# Altium schematic sheet Microcontroller.SchDoc
size 420 x 297 mm; Tanım / Description: Wireless Security Detector; Hazırlayan / Prepared By: MFY; Kontrol eden / Checked by: MFY; Onaylayan  /Approved by: MFY; Bölüm / Department: R&D - ARGE; Yayın Tarihi / Rel.date: 11.08.2025; Değ. tarihi / change date: 11.08.2025; Revizyon / Revision: AA; Size: A3
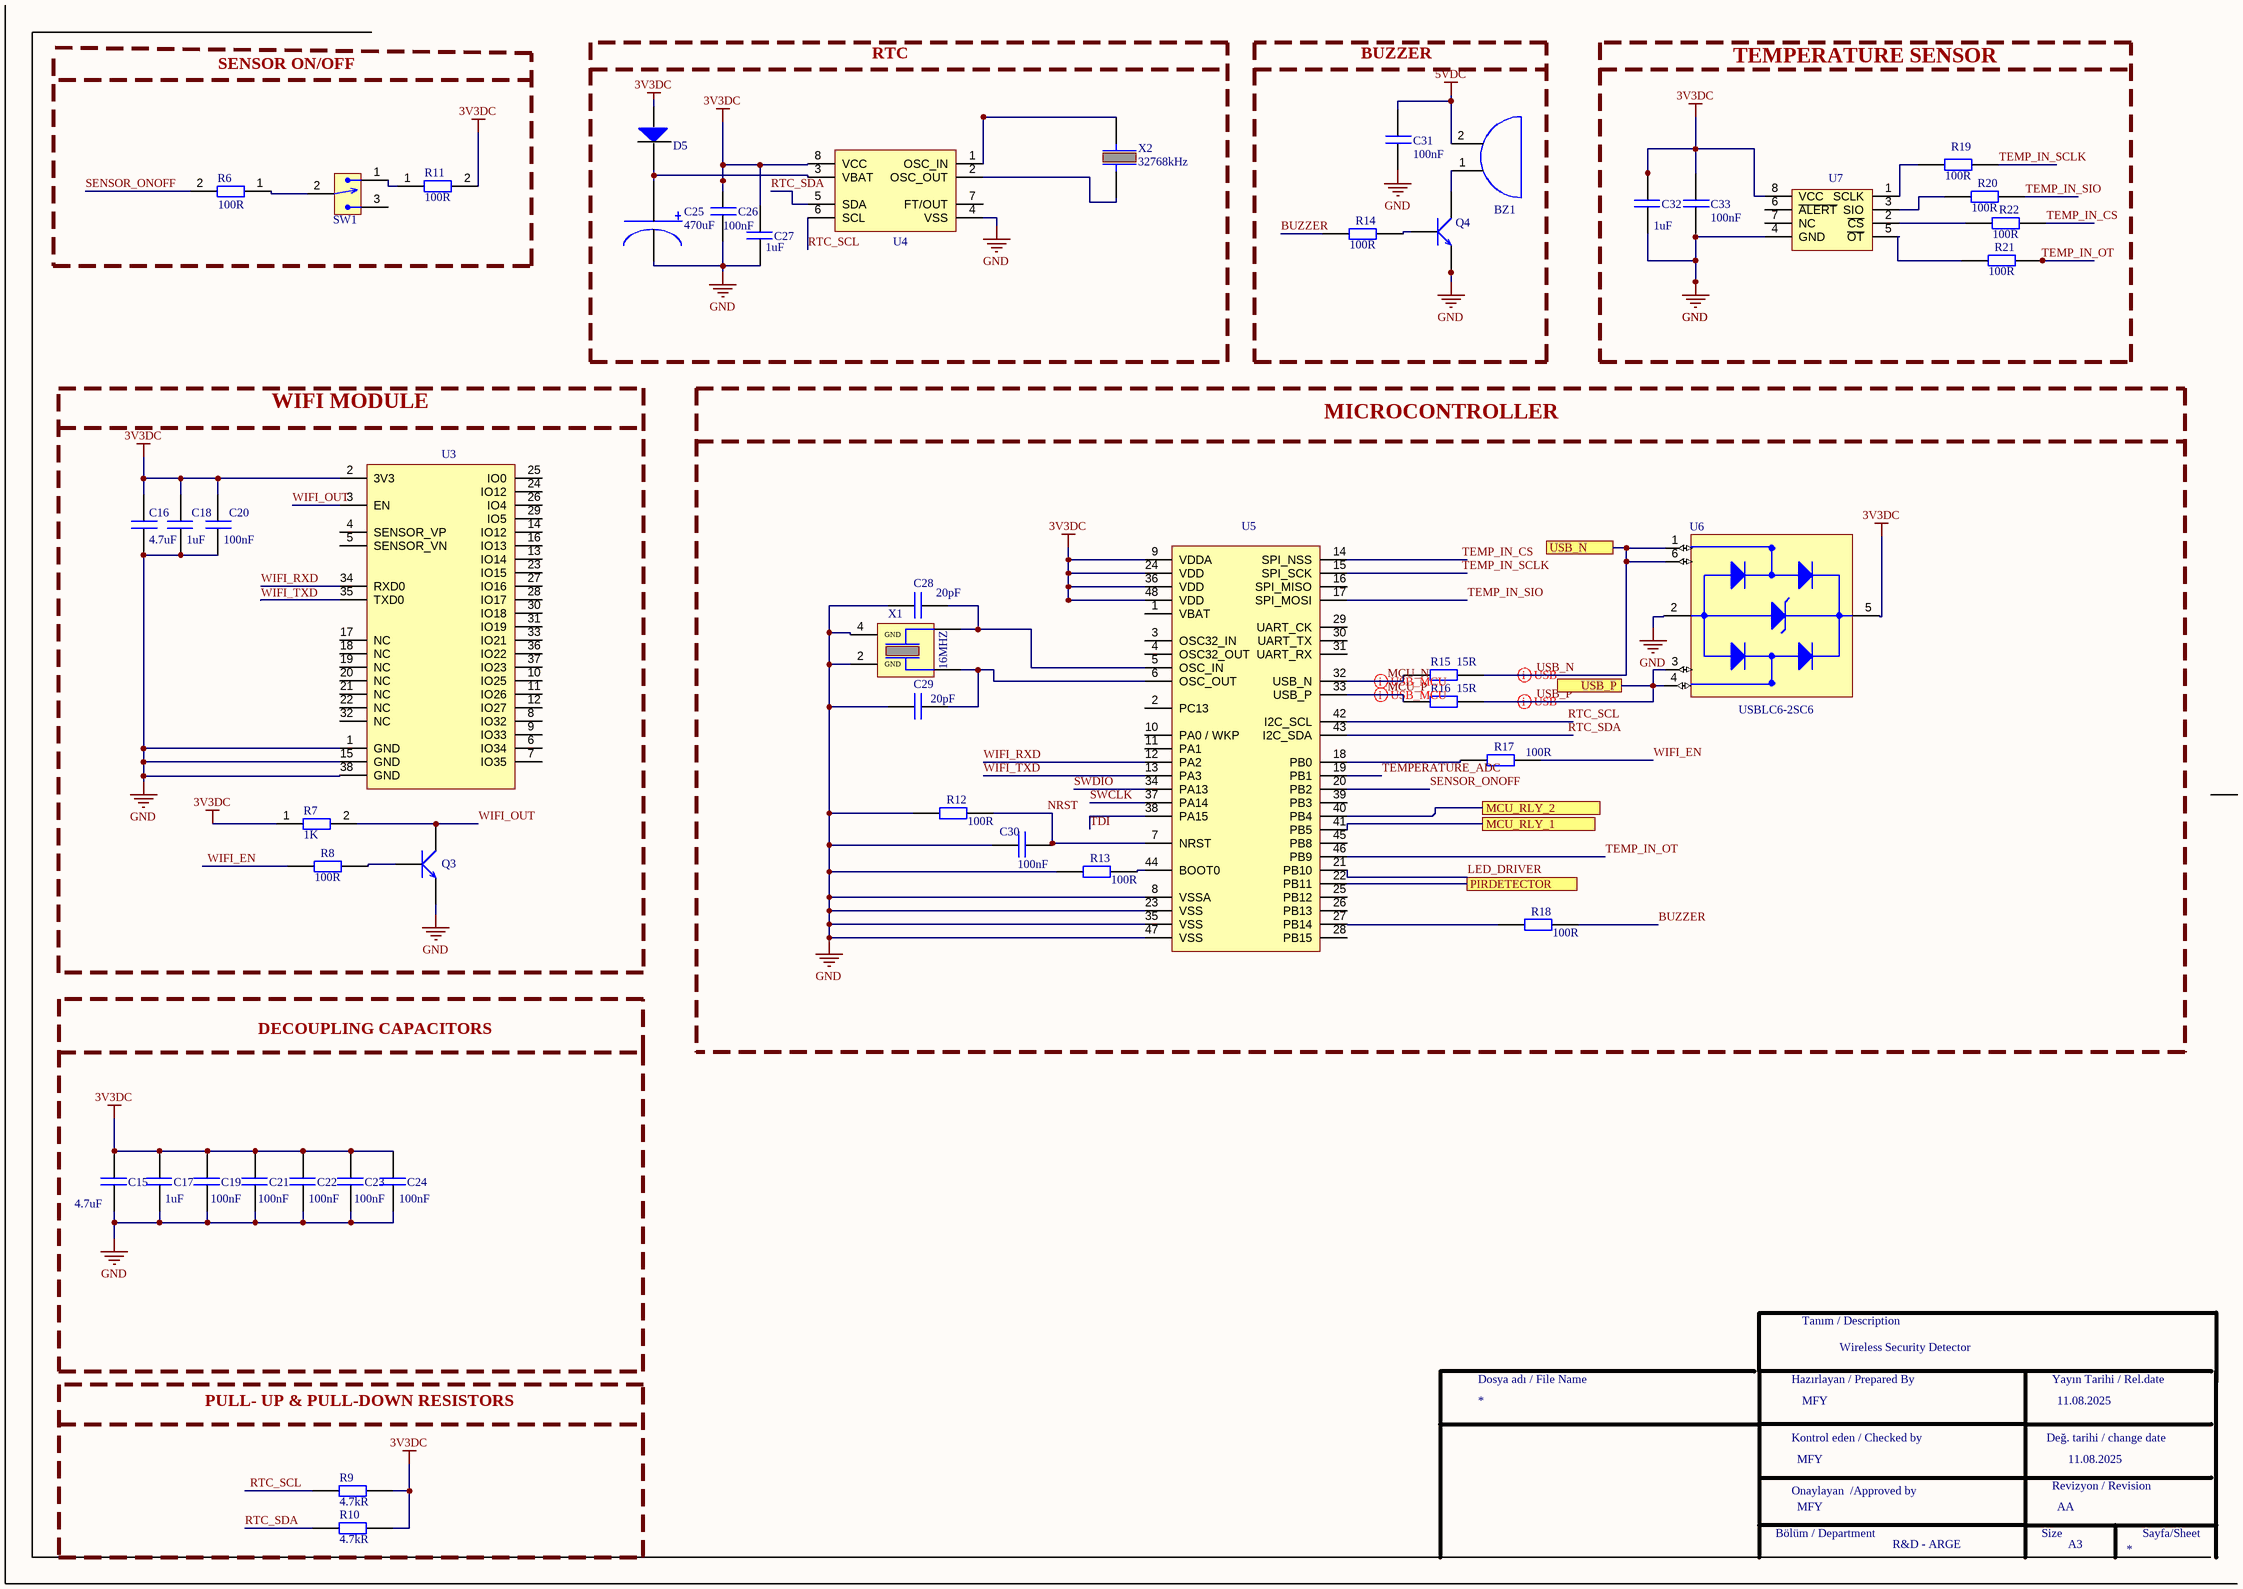
[diagram p0: Microcontroller.SchDoc]

## Parts
BZ1  CMI-9605IC-0580T  [CMI-9605IC-0580T]  (value not drawn)
C15  value 4.7uF  [CAP_0805]  (hidden comment: CL21A475KAQNNNE)
C16  value 4.7uF  [CAP_0805]  (hidden comment: CL21A475KAQNNNE)
C17  value 1uF  [CAP_0805]  (hidden comment: CL21B105KBFNNNE)
C18  value 1uF  [CAP_0805]  (hidden comment: CL21B105KBFNNNE)
C19  value 100nF  [CAP_0603]  (hidden comment: CAP CER 100nF 0603)
C20  value 100nF  [CAP_0805]  (hidden comment: CL21B104KBCNNNC)
C21  value 100nF  [CAP_0603]  (hidden comment: CAP CER 100nF 0603)
C22  value 100nF  [CAP_0603]  (hidden comment: CAP CER 100nF 0603)
C23  value 100nF  [CAP_0603]  (hidden comment: CAP CER 100nF 0603)
C24  value 100nF  [CAP_0603]  (hidden comment: CAP CER 100nF 0603)
C25  value 470uF  [CAP_RADIAL_D10_P5]  (hidden comment: ESH477M050AH4AA)
C26  value 100nF  [CAP_0805]  (hidden comment: CL21B104KBCNNNC)
C27  value 1uF  [CAP_0805]  (hidden comment: CL21B105KBFNNNE)
C28  value 20pF  [CAP_0603]  (hidden comment: CL10C200JB8NNNC)
C29  value 20pF  [CAP_0603]  (hidden comment: CL10C200JB8NNNC)
C30  value 100nF  [CAP_0603]  (hidden comment: CAP CER 100nF 0603)
C31  value 100nF  [CAP_0805]  (hidden comment: CL21B104KBCNNNC)
C32  value 1uF  [CAP_0805]  (hidden comment: CL21B105KBFNNNE)
C33  value 100nF  [CAP_0805]  (hidden comment: CL21B104KBCNNNC)
D5  1N4148WS  [SOD323F]  (value not drawn)
Q3  MMBT3904-7-F  [SOT23-F]  (value not drawn)
Q4  MMBT3904-7-F  [SOT23-F]  (value not drawn)
R6  value 100R  [RES_0603]  (hidden comment: RES 100 OHM 0603)
R7  value 1K  [RES_0603]  (hidden comment: RES 1K OHM 0603)
R8  value 100R  [RES_0603]  (hidden comment: RES 100 OHM 0603)
R9  value 4.7kR  [RES_0603]  (hidden comment: RC0603JR-074K7L)
R10  value 4.7kR  [RES_0603]  (hidden comment: RC0603JR-074K7L)
R11  value 100R  [RES_0603]  (hidden comment: RES 100 OHM 0603)
R12  value 100R  [RES_0603]  (hidden comment: RES 100 OHM 0603)
R13  value 100R  [RES_0603]  (hidden comment: RES 100 OHM 0603)
R14  value 100R  [RES_0603]  (hidden comment: RES 100 OHM 0603)
R15  value 15R  [RES_0603]  (hidden comment: RC0603JR-0715RL)
R16  value 15R  [RES_0603]  (hidden comment: RC0603JR-0715RL)
R17  value 100R  [RES_0603]  (hidden comment: RES 100 OHM 0603)
R18  value 100R  [RES_0603]  (hidden comment: RES 100 OHM 0603)
R19  value 100R  [RES_0603]  (hidden comment: RES 100 OHM 0603)
R20  value 100R  [RES_0603]  (hidden comment: RES 100 OHM 0603)
R21  value 100R  [RES_0603]  (hidden comment: RES 100 OHM 0603)
R22  value 100R  [RES_0603]  (hidden comment: RES 100 OHM 0603)
SW1  EG1215AA  [EG1215AA]  (value not drawn)
U3  ESP32-WROOM-32E(4MB)  [ESP32-32E]  (value not drawn)
U4  M41T00SM6F  [SOIC8]  (value not drawn)
U5  STM32F103C6T6A  [LQFP-48]  (value not drawn)
U6  USBLC6-2SC6  [SOT-23-6L]
U7  MAX6662MSA+  [SOIC8]  (value not drawn)
X1  Operating Frequency-Nom: 16MHZ  [ECS]  (hidden comment: ECS-160-20-30B-TR)
X2  Operating Frequency-Nom: 32768kHz  [ABS-05]  (hidden comment: ABS05-32768KHZ-T)

## Blocks framed on the sheet
RTC: C25-C27 D5 U4 X2
BUZZER: BZ1 C31 Q4 R14
TEMPERATURE SENSOR: C32 C33 R19-R22 U7
WIFI MODULE: C16 C18 C20 Q3 R7 R8 U3
MICROCONTROLLER: C28-C30 R12 R13 R15-R18 U5 U6 X1
PULL- UP & PULL-DOWN RESISTORS: R9 R10

## Ports
MCU_RLY_1 (see PowerManagement[1D]), MCU_RLY_2 (see PowerManagement[2D]), PIRDETECTOR (see PowerManagement[4B]), USB_N (see PowerManagement[3B]), USB_P (see PowerManagement[3B])

## Nets
3V3DC: C15.2 C16.1 C17.2 C18.2 C19.2 C20.1 C21.2 C22.2 C23.2 C24.2 C26.1 C27.2 C32.2 C33.1 D5.2 R7.1 R9.2 R10.2 R11.2 U3.2(3V3) U4.8(VCC) U5.9(VDDA) U5.24(VDD) U5.36(VDD) U5.48(VDD) U6.5(VBUS) U7.8(VCC)
5VDC: BZ1.2 C31.1
GND: C15.1 C16.2 C17.1 C18.1 C19.1 C20.2 C21.1 C22.1 C23.1 C24.1 C25.2 C26.2 C27.1 C28.1 C29.1 C30.1 C31.2 C32.1 C33.2 Q3.2(E) Q4.2(E) R12.1 R13.1 U3.1(GND) U3.15(GND) U3.38(GND) U4.4(VSS) U5.8(VSSA) U5.23(VSS) U5.35(VSS) U5.47(VSS) U6.2(GND) U7.4(GND) X1.2(GND) X1.4(GND)
BUZZER: R14.1 R18.2
LED_DRIVER: U5.21(PB10)
MCU_N: R15.1 U5.32(USB_N)
MCU_P: R16.1 U5.33(USB_P)
MCU_RLY_1: U5.41(PB5) ; port MCU_RLY_1
MCU_RLY_2: U5.40(PB4) ; port MCU_RLY_2
NRST: C30.2 R12.2 U5.7(NRST)
PIRDETECTOR: U5.22(PB11) ; port PIRDETECTOR
RTC_SCL: R9.1 U4.6(SCL) U5.42(I2C_SCL)
RTC_SDA: R10.1 U4.5(SDA) U5.43(I2C_SDA)
SENSOR_ONOFF: R6.2 U5.20(PB2)
SWCLK: U5.37(PA14)
SWDIO: U5.34(PA13)
TDI: U5.38(PA15)
TEMP_IN_CS: R22.2 U5.14(SPI_NSS)
TEMP_IN_OT: R21.2 U5.46(PB9)
TEMP_IN_SCLK: R19.2 U5.15(SPI_SCK)
TEMP_IN_SIO: R20.2 U5.17(SPI_MOSI)
TEMPERATURE_ADC: U5.19(PB1)
USB_N: R15.2 U6.1(I/O1_IN) U6.6(I/O1_OUT) ; port USB_N
USB_P: R16.2 U6.3(I/O2_IN) U6.4(I/O2_OUT) ; port USB_P
WIFI_EN: R8.1 R17.2
WIFI_OUT: Q3.3(C) R7.2 U3.3(EN)
WIFI_RXD: U3.34(RXD0) U5.12(PA2)
WIFI_TXD: U3.35(TXD0) U5.13(PA3)
NetBZ1_1: BZ1.1 Q4.3(C)
NetC25_1: C25.1 D5.1 U4.3(VBAT)
NetC28_2: C28.2 U5.5(OSC_IN) X1.3
NetC29_2: C29.2 U5.6(OSC_OUT) X1.1
NetQ3_1: Q3.1(B) R8.2
NetQ4_1: Q4.1(B) R14.2
NetR6_1: R6.1 SW1.2
NetR11_1: R11.1 SW1.1
NetR13_2: R13.2 U5.44(BOOT0)
NetR17_1: R17.1 U5.18(PB0)
NetR18_1: R18.1 U5.27(PB14)
NetR19_1: R19.1 U7.1(SCLK)
NetR20_1: R20.1 U7.3(SIO)
NetR21_1: R21.1 U7.5(~{OT})
NetR22_1: R22.1 U7.2(~{CS})
NetU4_1: U4.1(OSC_IN) X2.1
NetU4_2: U4.2(OSC_OUT) X2.2

Not connected (* = marked no-connect by the designer): SW1 3; U3 4(SENSOR_VP) 5(SENSOR_VN) 6(IO34) 7(IO35) 8(IO32) 9(IO33) 10(IO25) 11(IO26) 12(IO27) 13(IO14) 14(IO12) 16(IO13) 17(NC) 18(NC) 19(NC) 20(NC) 21(NC) 22(NC) 23(IO15) 24(IO12) 25(IO0) 26(IO4) 27(IO16) 28(IO17) 29(IO5) 30(IO18) 31(IO19) 32(NC) 33(IO21) 36(IO22) 37(IO23); U4 7(FT/OUT); U5 1(VBAT) 2(PC13) 3(OSC32_IN) 4(OSC32_OUT) 10(PA0_/_WKP) 11(PA1) 16(SPI_MISO) 25(PB12) 26(PB13) 28(PB15) 29(UART_CK) 30(UART_TX) 31(UART_RX) 39(PB3) 45(PB8); U7 6(~{ALERT}) 7(NC)

## Layout directives
differential pair: MCU_N, MCU_P, USB_N, USB_P

## Notes on the sheet
- SENSOR ON/OFF
- DECOUPLING CAPACITORS
- Tanım / Description
- Dosya adı / File Name
- Hazırlayan / Prepared By
- Yayın Tarihi / Rel.date
- Kontrol eden / Checked by
- Değ. tarihi / change date
- Bölüm / Department
- Onaylayan  /Approved by
- Size
- Revizyon / Revision
- Sayfa/Sheet

## Library data of the parts
BZ1 = CMI-9605IC-0580T: 9.6 mm, 5 Vdc, 80 dB, Through Hole, Driving Circuit, Magnetic Audio Indicator Buzzer; Manufacturer: Same Sky; DESIGNED BY: MFY; Supplier: Mouser; Supplier Part Number: 490-CMI-9605IC-0580T; Manufacturer Part Number: CMI-9605IC-0580T; RoHS: No; Category: Audio Products; Stock: 1255; Pricing: 1=1,46, 10=1,19, 50=1,03, 100=0,981, 1000=0,869, 10000=0,731 (USD); ComponentLink1URL: https://datasheet.octopart.com/CMI-9605IC-0580T-Same-Sky-datasheet-182879756.pdf?src-supplier=Electro+Sonic; ComponentLink1Description: https://datasheet.octopart.com/CMI-9605IC-0580T-Same-Sky-datasheet-182879756.pdf?src-supplier=Electro+Sonic; ComponentLink2URL: https://datasheet.octopart.com/CMI-9605IC-0580T-Same-Sky-datasheet-189104509.pdf?src-supplier=Master+Electronics; ComponentLink2Description: https://datasheet.octopart.com/CMI-9605IC-0580T-Same-Sky-datasheet-189104509.pdf?src-supplier=Master+Electronics; ComponentLink3URL: https://datasheet.octopart.com/CMI-9605IC-0580T-Same-Sky-datasheet-188930169.pdf?src-supplier=TME; ComponentLink3Description: https://datasheet.octopart.com/CMI-9605IC-0580T-Same-Sky-datasheet-188930169.pdf?src-supplier=TME; Case/Package: CMI9605-IC
C15 C16 = CAP CER 4.7uF 0805: Ceramic Capacitor, Multilayer, Ceramic, 25V, 10% +Tol, 10% -Tol, X5R, 15% TC, 4.7uF, Surface Mount, 0805; Manufacturer: Samsung; Multilayer: Yes; Supplier: Mouser; Supplier Part Number: 187-CL21A475KAQNNNE; Manufacturer Part Number: CL21A475KAQNNNE; RoHS: Yes; Category: Ceramic Capacitors; Stock: 101326; Pricing: 1=0,1, 10=0,039, 50=0,039, 100=0,032, 1000=0,022, 10000=0,012 (USD); Mounting Technology: Surface Mount; Pins: 2; Dielectric Material: Ceramic; Package Shape: Rectangular; Case/Package: 0805; Terminal Finish: Nickel; Min Operating Temperature: -55°C; Max Operating Temperature: 85°C; JESD-609 Code: e3; Capacitor Type: Ceramic; Tolerance  (fill in as +-): 10%; Package Style: SMTMeter; Packaging: Tape and Reel; Tolerance (fill in as +-): 10%; Rated DC Voltage (URdc): 25V; Temperature Characteristics Code: X5R; Termination: Wraparound; Length: 2mm; Width: 1.25mm; Height: 1.4mm; Reach SVHC Compliant: Yes; RoHS Compliant: Yes; ComponentLink1URL: https://datasheet.ciiva.com:443/pdfs/VipMasterIC/IC/SEMS/SEMS-S-A0008528919/SEMS-S-A0008528938-1.pdf?src-supplier=IHS+Markit; ComponentLink1Description: https://datasheet.ciiva.com:443/pdfs/VipMasterIC/IC/SEMS/SEMS-S-A0008528919/SEMS-S-A0008528938-1.pdf?src-supplier=IHS+Markit; ComponentLink2URL: https://datasheet.ciiva.com/25798/cl21a475kaqnnne-25798882.pdf?src-supplier=Digikey; ComponentLink2Description: https://datasheet.ciiva.com/25798/cl21a475kaqnnne-25798882.pdf?src-supplier=Digikey
C17 C18 C27 C32 = CAP CER 1uF 0805: Ceramic Capacitor, Multilayer, Ceramic, 50V, 10% +Tol, 10% -Tol, X7R, 15% TC, 1uF, Surface Mount, 0805; Manufacturer: Samsung; Multilayer: Yes; Supplier: Mouser; Supplier Part Number: 187-CL21B105KBFNNNE; Manufacturer Part Number: CL21B105KBFNNNE; RoHS: Yes; Category: Ceramic Capacitors; Stock: 619004; Pricing: 1=0,1, 10=0,016, 50=0,016, 100=0,013, 1000=0,013, 10000=0,011 (USD); Mounting Technology: Surface Mount; Pins: 2; Dielectric Material: Ceramic; Package Shape: Rectangular; Case/Package: 0805; Terminal Finish: Nickel; Min Operating Temperature: -55°C; Max Operating Temperature: 125°C; JESD-609 Code: e3; Capacitor Type: Ceramic; Tolerance  (fill in as +-): 10%; Package Style: SMTMeter; Packaging: Tape and Reel; Tolerance (fill in as +-): 10%; Rated DC Voltage (URdc): 50V; Temperature Characteristics Code: X7R; Termination: Wraparound; Length: 2mm; Width: 1.25mm; Height: 1.35mm; Reach SVHC Compliant: Yes; RoHS Compliant: Yes; ComponentLink1URL: https://datasheet.ciiva.com:443/pdfs/VipMasterIC/IC/SEMS/SEMS-S-A0008524728/SEMS-S-A0008523023-1.pdf?src-supplier=IHS+Markit; ComponentLink1Description: https://datasheet.ciiva.com:443/pdfs/VipMasterIC/IC/SEMS/SEMS-S-A0008524728/SEMS-S-A0008523023-1.pdf?src-supplier=IHS+Markit; ComponentLink2URL: https://datasheet.ciiva.com/16449/cl21b105kbfnnne-16449003.pdf?src-supplier=Future+Electronics; ComponentLink2Description: https://datasheet.ciiva.com/16449/cl21b105kbfnnne-16449003.pdf?src-supplier=Future+Electronics; ComponentLink3URL: https://datasheet.ciiva.com/25800/cl21b105kbfnnne-25800291.pdf?src-supplier=Digikey; ComponentLink3Description: https://datasheet.ciiva.com/25800/cl21b105kbfnnne-25800291.pdf?src-supplier=Digikey
C19 C21-C24 C30 = CAP CER 100nF 0603: CAP CER %10 100 nF 0603 Kemet; Manufacturer Part Number: C0603C104K5RACTU; Dielectric Material: Ceramic; Multilayer: Yes; Tolerance  (fill in as +-): 10%; Rated DC Voltage (URdc): 50V; Temperature Characteristics Code: X7R; Supplier: Mouser; Supplier Part Number: 80-C0603C104K5R; Manufacturer: KEMET; RoHS: Yes; Category: Ceramic Capacitors; Stock: 2298151; Pricing: 1=0,1, 10=0,012, 50=0,012, 100=0,011, 1000=0,011, 10000=0,01 (USD); Mounting Technology: Surface Mount; Pins: 2; Package Shape: Rectangular; Case/Package: 0603; Terminal Finish: Nickel; Min Operating Temperature: -55°C; Max Operating Temperature: 125°C; JESD-609 Code: e3; Capacitor Type: Ceramic; Package Style: SMTMeter; Packaging: Tape and Reel; Tolerance (fill in as +-): 10%; Termination: Wraparound; Length: 1.6mm; Width: 0.8mm; Height: 0.8mm; Reach SVHC Compliant: Yes; RoHS Compliant: Yes; ComponentLink1URL: https://datasheet.ciiva.com:443/pdfs/VipMasterIC/IC/KEME/KEME-S-A0008991654/KEME-S-A0008991654-1.pdf?src-supplier=IHS+Markit; ComponentLink1Description: https://datasheet.ciiva.com:443/pdfs/VipMasterIC/IC/KEME/KEME-S-A0008991654/KEME-S-A0008991654-1.pdf?src-supplier=IHS+Markit; ComponentLink2URL: https://datasheet.ciiva.com/7823/kem-c1002-x7r-smd-7823592.pdf?src-supplier=Element14; ComponentLink2Description: https://datasheet.ciiva.com/7823/kem-c1002-x7r-smd-7823592.pdf?src-supplier=Element14; ComponentLink3URL: https://datasheet.ciiva.com/28645/1851736-28645640.pdf?src-supplier=Element14; ComponentLink3Description: https://datasheet.ciiva.com/28645/1851736-28645640.pdf?src-supplier=Element14; ComponentLink4URL: https://datasheet.ciiva.com/14602/70095383-14602583.pdf?src-supplier=Allied+Electronics; ComponentLink4Description: https://datasheet.ciiva.com/14602/70095383-14602583.pdf?src-supplier=Allied+Electronics; ComponentLink5URL: https://datasheet.ciiva.com/7823/kem-c1002-x7r-smd-7823591.pdf?src-supplier=Element14; ComponentLink5Description: https://datasheet.ciiva.com/7823/kem-c1002-x7r-smd-7823591.pdf?src-supplier=Element14; ComponentLink6URL: https://datasheet.ciiva.com/5999/kem-c1002-x7r-smd-5999400.pdf?src-supplier=Farnell; ComponentLink6Description: https://datasheet.ciiva.com/5999/kem-c1002-x7r-smd-5999400.pdf?src-supplier=Farnell; ComponentLink7URL: https://datasheet.ciiva.com/14585/70095383-14585209.pdf?src-supplier=Allied+Electronics; ComponentLink7Description: https://datasheet.ciiva.com/14585/70095383-14585209.pdf?src-supplier=Allied+Electronics
C20 C26 C31 C33 = CAP CER 100nF 0805: Ceramic Capacitor, Multilayer, Ceramic, 50V, 10% +Tol, 10% -Tol, X7R, 15% TC, 0.1uF, Surface Mount, 0805; Manufacturer: Samsung; Multilayer: Yes; Supplier: Mouser; Supplier Part Number: 187-CL21B104KBCNNNC; Manufacturer Part Number: CL21B104KBCNNNC; RoHS: Yes; Category: Ceramic Capacitors; Stock: 699327; Pricing: 1=0,1, 10=0,006, 50=0,006, 100=0,006, 1000=0,006, 10000=0,005 (USD); Mounting Technology: Surface Mount; Pins: 2; Dielectric Material: Ceramic; Package Shape: Rectangular; Case/Package: 0805; Terminal Finish: Nickel; Min Operating Temperature: -55°C; Max Operating Temperature: 125°C; JESD-609 Code: e3; Capacitor Type: Ceramic; Tolerance  (fill in as +-): 10%; Package Style: SMTMeter; Packaging: Tape and Reel; Tolerance (fill in as +-): 10%; Rated DC Voltage (URdc): 50V; Temperature Characteristics Code: X7R; Termination: Wraparound; Length: 2mm; Width: 1.25mm; Height: 0.95mm; Reach SVHC Compliant: Yes; RoHS Compliant: Yes; ComponentLink1URL: https://datasheet.ciiva.com:443/pdfs/VipMasterIC/IC/SEMS/SEMS-S-A0008521003/SEMS-S-A0008521039-1.pdf?src-supplier=IHS+Markit; ComponentLink1Description: https://datasheet.ciiva.com:443/pdfs/VipMasterIC/IC/SEMS/SEMS-S-A0008521003/SEMS-S-A0008521039-1.pdf?src-supplier=IHS+Markit; ComponentLink2URL: https://datasheet.ciiva.com/25710/cl21b104kbcnnnc-25710182.pdf?src-supplier=Digikey; ComponentLink2Description: https://datasheet.ciiva.com/25710/cl21b104kbcnnnc-25710182.pdf?src-supplier=Digikey; ComponentLink3URL: https://datasheet.ciiva.com/29199/454152-da-01-en-vs-kondensator-0805-29199814.pdf?src-supplier=Conrad; ComponentLink3Description: https://datasheet.ciiva.com/29199/454152-da-01-en-vs-kondensator-0805-29199814.pdf?src-supplier=Conrad
C25 = CAP ALU ELEC 470uF 50V: Aluminum Electrolytic Capacitor, Polarized, Aluminum (wet), 50V, 20% +Tol, 20% -Tol, 470uF, Through Hole Mount; Manufacturer: KEMET; Dielectric Material: Aluminium; Leakage Current: 235uA; Ripple Current: 630mA; Tan Delta: 0.12; Supplier: Mouser; Supplier Part Number: 80-ESH477M050AH4AA; Manufacturer Part Number: ESH477M050AH4AA; RoHS: Yes; Category: Capacitors; Stock: 31; Pricing: 1=0,55, 10=0,338, 50=0,338, 100=0,251, 1000=0,206, 10000=0,174 (USD); Mounting Technology: Through Hole; Pins: 2; Package Shape: Cylindrical; Min Operating Temperature: -40°C; Max Operating Temperature: 105°C; Polarity: Polarized; Capacitor Type: Aluminium; Tolerance  (fill in as +-): 20%; Packaging: Bulk; Tolerance (fill in as +-): 20%; Rated DC Voltage (URdc): 50V; Termination: Wire; Reach SVHC Compliant: Yes; RoHS Compliant: Yes; ComponentLink1URL: https://datasheet.ciiva.com:443/pdfs/VipMasterIC/IC/KEME/KEME-S-A0008512286/KEME-S-A0008512286-1.pdf?src-supplier=IHS+Markit; ComponentLink1Description: https://datasheet.ciiva.com:443/pdfs/VipMasterIC/IC/KEME/KEME-S-A0008512286/KEME-S-A0008512286-1.pdf?src-supplier=IHS+Markit; ComponentLink2URL: https://api.kemet.com/component-edge/download/datasheet/ESH477M050AH4AA.pdf?src-supplier=Digikey; ComponentLink2Description: https://api.kemet.com/component-edge/download/datasheet/ESH477M050AH4AA.pdf?src-supplier=Digikey; ComponentLink3URL: https://datasheet.octopart.com/ESH477M050AH4AA-KEMET-datasheet-130075338.pdf?src-supplier=Newark; ComponentLink3Description: https://datasheet.octopart.com/ESH477M050AH4AA-KEMET-datasheet-130075338.pdf?src-supplier=Newark; ComponentLink4URL: https://datasheet.octopart.com/ESH477M050AH4AA-KEMET-datasheet-157246171.pdf?src-supplier=Element14; ComponentLink4Description: https://datasheet.octopart.com/ESH477M050AH4AA-KEMET-datasheet-157246171.pdf?src-supplier=Element14
C28 C29 = CAP CER 20 pF 0603: Ceramic Capacitor, Multilayer, Ceramic, 50V, 5% +Tol, 5% -Tol, C0G, -/+30ppm/Cel TC, 0.00002uF, Surface Mount, 0603; Manufacturer: Samsung; Multilayer: Yes; Supplier: Mouser; Supplier Part Number: 187-CL10C200JB8NNNC; Manufacturer Part Number: CL10C200JB8NNNC; RoHS: Yes; Category: Ceramic Capacitors; Stock: 32130; Pricing: 1=0,1, 10=0,024, 50=0,024, 100=0,02, 1000=0,013, 10000=0,007 (USD); Mounting Technology: Surface Mount; Pins: 2; Dielectric Material: Ceramic; Package Shape: Rectangular; Case/Package: 0603; Terminal Finish: Nickel; Min Operating Temperature: -55°C; Max Operating Temperature: 125°C; JESD-609 Code: e3; Capacitor Type: Ceramic; Tolerance  (fill in as +-): 5%; Package Style: SMTMeter; Packaging: Tape and Reel; Tolerance (fill in as +-): 5%; Rated DC Voltage (URdc): 50V; Temperature Characteristics Code: C0G; Termination: Wraparound; Length: 1.6mm; Width: 0.8mm; Height: 0.9mm; Reach SVHC Compliant: Yes; RoHS Compliant: Yes; ComponentLink1URL: https://datasheet.ciiva.com:443/pdfs/VipMasterIC/IC/SEMS/SEMS-S-A0008520096/SEMS-S-A0008519968-1.pdf?src-supplier=IHS+Markit; ComponentLink1Description: https://datasheet.ciiva.com:443/pdfs/VipMasterIC/IC/SEMS/SEMS-S-A0008520096/SEMS-S-A0008519968-1.pdf?src-supplier=IHS+Markit; ComponentLink2URL: https://datasheet.ciiva.com/26877/getdatasheetpartid-640634-26877974.pdf?src-supplier=Verical; ComponentLink2Description: https://datasheet.ciiva.com/26877/getdatasheetpartid-640634-26877974.pdf?src-supplier=Verical; ComponentLink3URL: https://datasheet.ciiva.com/26310/mlcc-catalogdownload2013-eng-26310315.pdf?src-supplier=Distrelec; ComponentLink3Description: https://datasheet.ciiva.com/26310/mlcc-catalogdownload2013-eng-26310315.pdf?src-supplier=Distrelec
D5 = 1N4148WS: Rectifier Diode, 1 Phase, 1 Element, 0.15A, 100V V(RRM), Silicon; Manufacturer: onsemi; Package Body Material: Plastic; Number of Elements: 1; Max Output current: 150mA; Reverse Recovery Time-Max: 0.004us; Qualification Status: Not Qualified; Forward Voltage: 1V; Supplier: Mouser; Supplier Part Number: 512-1N4148WS; Manufacturer Part Number: 1N4148WS; RoHS: Yes; Category: Rectifier Diodes; Stock: 898084; Pricing: 1=0,11, 10=0,066, 50=0,066, 100=0,062, 1000=0,041, 10000=0,019 (USD); Pins: 2; Diode Element Material: SILICON; Package Shape: Rectangular; Max Operating Temperature: 150°C; Diode Type: RECTIFIER; JESD-30 Code: R-PDSO-F2; Package Style: SMALL OUTLINEMeter; Rep Pk Reverse Voltage-Max: 100V; Surface Mount: Yes; Terminal Form: Flat; Terminal Position: DUAL; Moisture Sensitivity Level: 1; Reach SVHC Compliant: Yes; RoHS Compliant: Yes; ComponentLink1URL: https://datasheet.ciiva.com:443/pdfs/VipMasterIC/IC/ONSM/ONSM-S-A0003392874/ONSM-S-A0003585195-1.pdf?src-supplier=IHS+Markit; ComponentLink1Description: https://datasheet.ciiva.com:443/pdfs/VipMasterIC/IC/ONSM/ONSM-S-A0003392874/ONSM-S-A0003585195-1.pdf?src-supplier=IHS+Markit
Q3 Q4 = MMBT3904-7-F: Small Signal Bipolar Transistor, 0.2A I(C), 40V V(BR)CEO, 1-Element, NPN, Silicon SOT-23F (DAHA ÖNCEDEN footprinti VARDI).; Manufacturer: Diodes Zetex; Package Body Material: Plastic; Additional Feature: HIGH RELIABILITY; Max Collector Current: 200mA; DC Current Gain-Min (hFE): 30; Number of Elements: 1; Power Dissipation-Max (Abs): 300mW; Time @ Peak Reflow Temperature-Max (s): 40s; Transistor Application: SWITCHING; Frequency: 300MHz; Turn-off Time-Max (toff): 250ns; Turn-on Time-Max (ton): 70ns; Qualification Status: Not Qualified; DESIGNED BY: MFY; Supplier: Mouser; Supplier Part Number: 621-MMBT3904-F; Manufacturer Part Number: MMBT3904-7-F; RoHS: Yes; Category: BJTs; Stock: 1405536; Pricing: 1=0,11, 10=0,052, 50=0,052, 100=0,036, 1000=0,025, 10000=0,016 (USD); Pins: 3; Package Shape: Rectangular; Terminal Finish: Tin; Transistor Element Material: SILICON; Max Operating Temperature: 150°C; JESD-609 Code: e3; Polarity/Channel Type: NPN; Collector-emitter Voltage-Max: 40V; JESD-30 Code: R-PDSO-G3; Moisture Sensitivity Level: 1; Package Style: SMALL OUTLINEMeter; Peak Reflow Temperature (Cel): 260°C; Surface Mount: Yes; Terminal Form: Gull Wing; Terminal Position: DUAL; Reach SVHC Compliant: Yes; RoHS Compliant: Yes; ComponentLink1URL: https://datasheet.ciiva.com:443/pdfs/VipMasterIC/IC/DIOD/DIOD-S-A0003133141/DIOD-S-A0003133141-1.pdf?src-supplier=IHS+Markit; ComponentLink1Description: https://datasheet.ciiva.com:443/pdfs/VipMasterIC/IC/DIOD/DIOD-S-A0003133141/DIOD-S-A0003133141-1.pdf?src-supplier=IHS+Markit; ComponentLink2URL: https://datasheet.ciiva.com/11201/ds30036-11201778.pdf?src-supplier=Avnet; ComponentLink2Description: https://datasheet.ciiva.com/11201/ds30036-11201778.pdf?src-supplier=Avnet; ComponentLink3URL: https://datasheet.ciiva.com/15138/getdatasheetpartid-53265-15138780.pdf?src-supplier=Verical; ComponentLink3Description: https://datasheet.ciiva.com/15138/getdatasheetpartid-53265-15138780.pdf?src-supplier=Verical; ComponentLink4URL: https://datasheet.ciiva.com/22711/1915516-22711750.pdf?src-supplier=Element14; ComponentLink4Description: https://datasheet.ciiva.com/22711/1915516-22711750.pdf?src-supplier=Element14; ComponentLink5URL: https://datasheet.ciiva.com/11198/ds30036-11198999.pdf?src-supplier=Avnet; ComponentLink5Description: https://datasheet.ciiva.com/11198/ds30036-11198999.pdf?src-supplier=Avnet; ComponentLink6URL: https://datasheet.ciiva.com/6361/ds30036-6361256.pdf?src-supplier=Digikey; ComponentLink6Description: https://datasheet.ciiva.com/6361/ds30036-6361256.pdf?src-supplier=Digikey; ComponentLink7URL: https://datasheet.ciiva.com/6361/ds30036-6361254.pdf?src-supplier=Digikey; ComponentLink7Description: https://datasheet.ciiva.com/6361/ds30036-6361254.pdf?src-supplier=Digikey
R9 R10 = RES 4.7K 0603: RES 4K7 Surface Mount, 0603; Manufacturer: Yageo; Tolerance: 5%; Additional Feature: LASER TRIMMABLE; Rated Temperature: 70°C; Working Voltage: 75V; Temperature Coefficient (ppm/Cel): 100; Package Height: 0.45mm; Package Length: 1.6mm; Package Width: 0.8mm; Power: 100mW; Supplier: Mouser; Manufacturer Part Number: RC0603JR-074K7L; RoHS: Yes; Category: Chip SMD Resistors; Stock: 508549; Pricing: 1=0,1, 10=0,008, 50=0,008, 100=0,006, 1000=0,005, 10000=0,002 (USD); Mounting Technology: Surface Mount; Pins: 2; Package Shape: Rectangular; Case/Package: 0603; Terminal Finish: Nickel; Min Operating Temperature: -55°C; Max Operating Temperature: 155°C; JESD-609 Code: e3; Resistor Type: FIXED RESISTOR; Construction: Chip; Packaging: Tape and Reel; Technology: METAL GLAZE/THICK FILM; Termination: Wraparound; Reach SVHC Compliant: Yes; RoHS Compliant: Yes; ComponentLink1URL: https://datasheet.ciiva.com:443/pdfs/VipMasterIC/IC/YAGO/YAGO-S-A0008145938/YAGO-S-A0008145938-1.pdf?src-supplier=IHS+Markit; ComponentLink1Description: https://datasheet.ciiva.com:443/pdfs/VipMasterIC/IC/YAGO/YAGO-S-A0008145938/YAGO-S-A0008145938-1.pdf?src-supplier=IHS+Markit; ComponentLink2URL: https://datasheet.ciiva.com/46412/443971-46412858.pdf?src-supplier=Element14; ComponentLink2Description: https://datasheet.ciiva.com/46412/443971-46412858.pdf?src-supplier=Element14; Supplier Part Number: 603-RC0603JR-074K7L
R15 R16 = RES 15R 0603: Fixed Resistor, Metal Glaze/thick Film, 0.1W, 15ohm, 75V, 5% +/-Tol, 100ppm/Cel, Surface Mount, 0603; Manufacturer: Yageo; Additional Feature: LASER TRIMMABLE; Power: 100mW; Rated Temperature: 70°C; Temperature Coefficient (ppm/Cel): 100; Package Height: 0.45mm; Package Length: 1.6mm; Package Width: 0.8mm; Supplier: Mouser; Supplier Part Number: 603-RC0603JR-0715RL; Manufacturer Part Number: RC0603JR-0715RL; RoHS: Yes; Category: Chip SMD Resistors; Stock: 813685; Pricing: 1=0,1, 10=0,007, 50=0,007, 100=0,005, 1000=0,003, 10000=0,002 (USD); Mounting Technology: Surface Mount; Pins: 2; Package Shape: Rectangular; Case/Package: 0603; Terminal Finish: Nickel; Min Operating Temperature: -55°C; Max Operating Temperature: 155°C; Tolerance: 5%; JESD-609 Code: e3; Resistor Type: FIXED RESISTOR; Construction: Chip; Packaging: Tape and Reel; Technology: METAL GLAZE/THICK FILM; Termination: Wraparound; Working Voltage: 75V; Reach SVHC Compliant: Yes; RoHS Compliant: Yes; ComponentLink1URL: https://datasheet.ciiva.com:443/pdfs/VipMasterIC/IC/YAGO/YAGO-S-A0008145938/YAGO-S-A0008145938-1.pdf?src-supplier=IHS+Markit; ComponentLink1Description: https://datasheet.ciiva.com:443/pdfs/VipMasterIC/IC/YAGO/YAGO-S-A0008145938/YAGO-S-A0008145938-1.pdf?src-supplier=IHS+Markit; ComponentLink2URL: https://datasheet.ciiva.com/2453/pyu-r-int-thick-7-2453085.pdf?src-supplier=Digikey; ComponentLink2Description: https://datasheet.ciiva.com/2453/pyu-r-int-thick-7-2453085.pdf?src-supplier=Digikey; ComponentLink3URL: https://datasheet.ciiva.com/2453/pyu-r-int-thick-7-2453086.pdf?src-supplier=Digikey; ComponentLink3Description: https://datasheet.ciiva.com/2453/pyu-r-int-thick-7-2453086.pdf?src-supplier=Digikey; ComponentLink4URL: https://datasheet.ciiva.com/2453/pyu-r-int-thick-7-2453087.pdf?src-supplier=Digikey; ComponentLink4Description: https://datasheet.ciiva.com/2453/pyu-r-int-thick-7-2453087.pdf?src-supplier=Digikey; ComponentLink5URL: https://datasheet.ciiva.com/7746/443971-7746445.pdf?src-supplier=Element14; ComponentLink5Description: https://datasheet.ciiva.com/7746/443971-7746445.pdf?src-supplier=Element14; ComponentLink6URL: https://datasheet.ciiva.com/7746/443971-7746446.pdf?src-supplier=Element14; ComponentLink6Description: https://datasheet.ciiva.com/7746/443971-7746446.pdf?src-supplier=Element14
SW1 = EG1215AA: Slide Switch; Manufacturer: E-Switch; DESIGNED BY: MFY; Supplier: Farnell; Supplier Part Number: 4050996; Manufacturer Part Number: EG1215AA; RoHS: Yes; Category: LDO; Stock: 3432; Pricing: 1=0,96, 10=0,815, 25=0,757, 50=0,717, 100=0,676 (EUR); ComponentLink1URL: https://media.digikey.com/pdf/Data%20Sheets/E-Switch%20PDFs/EG1215_Series_Ds.pdf?src-supplier=Digikey; ComponentLink1Description: https://media.digikey.com/pdf/Data%20Sheets/E-Switch%20PDFs/EG1215_Series_Ds.pdf?src-supplier=Digikey; ComponentLink2URL: http://www.farnell.com/datasheets/2645007.pdf?src-supplier=Farnell; ComponentLink2Description: http://www.farnell.com/datasheets/2645007.pdf?src-supplier=Farnell; ComponentLink3URL: https://datasheet.octopart.com/EG1215AA-E-Switch-datasheet-156105969.pdf?src-supplier=Future+Electronics; ComponentLink3Description: https://datasheet.octopart.com/EG1215AA-E-Switch-datasheet-156105969.pdf?src-supplier=Future+Electronics; ComponentLink4URL: https://datasheet.octopart.com/EG1215AA-E-Switch-datasheet-101745667.pdf?src-supplier=Electro+Sonic; ComponentLink4Description: https://datasheet.octopart.com/EG1215AA-E-Switch-datasheet-101745667.pdf?src-supplier=Electro+Sonic
U3 = ESP32-WROOM-32E(4MB): WiFi-Module 802.11/BT 2, 4-2, 5GHz 150Mb/s; Manufacturer: Espressif Systems; Manufacturer Part Number: ESP32-WROOM-32E-N4; DESIGNED BY: MFY; Supplier: Future Electronics; Supplier Part Number: 1157710; RoHS: No; Category: LDO; Pricing: 650=2,45, 1300=2,42 (USD); ComponentLink1URL: https://datasheet.octopart.com/ESP32-WROOM-32E-N4-Espressif-Systems-datasheet-151884363.pdf?src-supplier=Future+Electronics; ComponentLink1Description: https://datasheet.octopart.com/ESP32-WROOM-32E-N4-Espressif-Systems-datasheet-151884363.pdf?src-supplier=Future+Electronics; ComponentLink2URL: https://datasheet.octopart.com/ESP32-WROOM-32E-N4-Espressif-Systems-datasheet-188867343.pdf?src-supplier=TME; ComponentLink2Description: https://datasheet.octopart.com/ESP32-WROOM-32E-N4-Espressif-Systems-datasheet-188867343.pdf?src-supplier=TME
U4 = M41T00SM6F: Real Time Clock, Volatile, 0 Timer(s), CMOS, PDSO8; Manufacturer: STMicroelectronics; DESIGNED BY: MFY; Package Body Material: Plastic; Clock Frequency: 32kHz; Package Equivalence Code: SOP8,.25; Power Supplies: 3/5V; Max Supply Voltage: 5.5V; Min Supply Voltage: 2.7V; Time @ Peak Reflow Temperature-Max (s): 30s; Qualification Status: Not Qualified; Supplier: Mouser; Supplier Part Number: 511-M41T00SM6F; Manufacturer Part Number: M41T00SM6F; RoHS: Yes; Category: Real Time Clocks; Stock: 6978; Pricing: 1=3,31, 10=2,49, 50=2,29, 100=2,06, 1000=1,83, 10000=1,74 (USD); Case/Package: SOIC; Pins: 8; Package Shape: Rectangular; Terminal Finish: Nickel; Min Operating Temperature: -40°C; Max Operating Temperature: 85°C; JESD-609 Code: e4; JESD-30 Code: R-PDSO-G8; Moisture Sensitivity Level: 1; Package Style: SMALL OUTLINEMeter; Peak Reflow Temperature (Cel): 260°C; Surface Mount: Yes; Technology: CMOS; Terminal Form: Gull Wing; Terminal Position: DUAL; Length: 4.9mm; Width: 3.9mm; Height - Seated (Max): 1.75mm; Terminal Pitch: 1.27mm; Reach SVHC Compliant: Yes; RoHS Compliant: Yes; Temperature Grade: INDUSTRIAL; ComponentLink1URL: https://datasheet.ciiva.com:443/pdfs/VipMasterIC/IC/SGST/SGSTS30285/SGSTS30285-1.pdf?src-supplier=IHS+Markit; ComponentLink1Description: https://datasheet.ciiva.com:443/pdfs/VipMasterIC/IC/SGST/SGSTS30285/SGSTS30285-1.pdf?src-supplier=IHS+Markit; ComponentLink2URL: https://datasheet.ciiva.com/4772/cd00043079-112038-4772343.pdf?src-supplier=Mouser; ComponentLink2Description: https://datasheet.ciiva.com/4772/cd00043079-112038-4772343.pdf?src-supplier=Mouser; ComponentLink3URL: https://datasheet.ciiva.com/16219/cd00043079-16219612.pdf?src-supplier=Future+Electronics; ComponentLink3Description: https://datasheet.ciiva.com/16219/cd00043079-16219612.pdf?src-supplier=Future+Electronics
U5 = STM32F103C6T6A: RISC Microcontroller, 32-Bit, FLASH, CORTEX-M3 CPU, 72MHz, CMOS, LQFP48; Manufacturer: STMicroelectronics; Package Body Material: Plastic; Package Equivalence Code: QFP48,.35SQ,20; Power Supplies: 2.5/3.3; Max Supply Current: 45mA; Time @ Peak Reflow Temperature-Max (s): 40s; Qualification Status: Not Qualified; DESIGNED BY: MFY; Supplier: Mouser; Supplier Part Number: 511-STM32F103C6T6A; Manufacturer Part Number: STM32F103C6T6A; RoHS: Yes; Category: Microcontrollers; Stock: 2247; Pricing: 1=5,48, 10=4,2, 50=3,87, 100=3,52, 1000=3,23, 10000=3,14 (USD); Case/Package: LQFP; Pins: 48; Package Shape: Square; Terminal Finish: Nickel; Min Operating Temperature: -40°C; Max Operating Temperature: 85°C; JESD-609 Code: e4; JESD-30 Code: S-PQFP-G48; Moisture Sensitivity Level: 3; Peak Reflow Temperature (Cel): 260°C; Surface Mount: Yes; Technology: CMOS; Terminal Form: Gull Wing; Terminal Position: QUAD; Terminal Pitch: 0.5mm; Temperature Grade: INDUSTRIAL; Reach SVHC Compliant: Yes; RoHS Compliant: Yes; ComponentLink1URL: https://datasheet.ciiva.com:443/pdfs/VipMasterIC/IC/SGST/SGST-S-A0001117150/SGST-S-A0001117150-1.pdf?src-supplier=IHS+Markit; ComponentLink1Description: https://datasheet.ciiva.com:443/pdfs/VipMasterIC/IC/SGST/SGST-S-A0001117150/SGST-S-A0001117150-1.pdf?src-supplier=IHS+Markit; ComponentLink2URL: https://datasheet.ciiva.com/15122/getdatasheetpartid-69879-15122075.pdf?src-supplier=Verical; ComponentLink2Description: https://datasheet.ciiva.com/15122/getdatasheetpartid-69879-15122075.pdf?src-supplier=Verical; ComponentLink3URL: https://datasheet.ciiva.com/14100/pustm-arm-microcont-stm32f103-en-14100507.pdf?src-supplier=Distrelec; ComponentLink3Description: https://datasheet.ciiva.com/14100/pustm-arm-microcont-stm32f103-en-14100507.pdf?src-supplier=Distrelec
U6 = USB PROTECTION: Trans Voltage Suppressor Diode, 5V V(RWM), Unidirectional, 1 Element, Silicon; Manufacturer: STMicroelectronics; Package Body Material: Plastic; Additional Feature: HIGH RELIABILITY; Min Breakdown Voltage: 6V; Number of Elements: 1; Clamping Voltage-Max: 17V; Reference Standard: IEC-61000-4-2; Qualification Status: Not Qualified; Supplier: Mouser; Supplier Part Number: 511-USBLC6-2SC6; Manufacturer Part Number: USBLC6-2SC6; RoHS: Yes; Category: TVS Diodes; Stock: 120276; Pricing: 1=0,36, 10=0,243, 50=0,243, 100=0,163, 1000=0,114, 10000=0,075 (USD); Pins: 6; Package Shape: Rectangular; Terminal Finish: Tin; Diode Element Material: SILICON; Min Operating Temperature: -40°C; Max Operating Temperature: 125°C; JESD-609 Code: e3; Polarity: Unidirectional; Package Style: SMALL OUTLINEMeter; Diode Type: TRANS VOLTAGE SUPPRESSOR; JESD-30 Code: R-PDSO-G6; Moisture Sensitivity Level: 1; Rep Pk Reverse Voltage-Max: 5V; Surface Mount: Yes; Technology: AVALANCHE; Terminal Form: Gull Wing; Terminal Position: DUAL; Peak Reflow Temperature (Cel): 260°C; Reach SVHC Compliant: Yes; RoHS Compliant: Yes; ComponentLink1URL: https://datasheet.ciiva.com:443/pdfs/VipMasterIC/IC/SGST/SGSTS30336/SGSTS30336-1.pdf?src-supplier=IHS+Markit; ComponentLink1Description: https://datasheet.ciiva.com:443/pdfs/VipMasterIC/IC/SGST/SGSTS30336/SGSTS30336-1.pdf?src-supplier=IHS+Markit; ComponentLink2URL: https://datasheet.ciiva.com/1268/1690354-1268384.pdf?src-supplier=Element14; ComponentLink2Description: https://datasheet.ciiva.com/1268/1690354-1268384.pdf?src-supplier=Element14; ComponentLink3URL: https://datasheet.ciiva.com/4508/cd00050750-113117-4508433.pdf?src-supplier=Mouser; ComponentLink3Description: https://datasheet.ciiva.com/4508/cd00050750-113117-4508433.pdf?src-supplier=Mouser; ComponentLink4URL: https://datasheet.ciiva.com/15143/getdatasheetpartid-148465-15143789.pdf?src-supplier=Verical; ComponentLink4Description: https://datasheet.ciiva.com/15143/getdatasheetpartid-148465-15143789.pdf?src-supplier=Verical; ComponentLink5URL: https://datasheet.ciiva.com/16200/cd00050750-16200026.pdf?src-supplier=Future+Electronics; ComponentLink5Description: https://datasheet.ciiva.com/16200/cd00050750-16200026.pdf?src-supplier=Future+Electronics; ComponentLink6URL: https://datasheet.ciiva.com/41444/001184109-da-01-en-ic-esd-protecti-usblc6-2sc6-sot-23-6-stm-41444156.pdf?src-supplier=Conrad; ComponentLink6Description: https://datasheet.ciiva.com/41444/001184109-da-01-en-ic-esd-protecti-usblc6-2sc6-sot-23-6-stm-41444156.pdf?src-supplier=Conrad
U7 = MAX6662MSA+: Serial Switch/Digital Sensor, 12 Bit(s), 2.50Cel, BICMOS, Rectangular, 8 Pin, Surface Mount; Manufacturer: Maxim; Package Body Material: Plastic; Accuracy-Max (Cel): 2.5°C; Number of Bits: 12; Operating Current-Max: 120uA; Output Interface Type: 3-WIRE; Package Equivalence Code: SOP8,.25; Power Supplies: 3.3/5V; Sensor Type: TEMPERATURE SENSOR,SWITCH/DIGITAL OUTPUT,SERIAL; Body Breadth: 3.9mm; Body Height: 1.72mm; Body Length or Diameter: 4.89mm; Supplier: Mouser; Supplier Part Number: 700-MAX6662MSA; Manufacturer Part Number: MAX6662MSA+; RoHS: Yes; Category: Temperature and Humidity Sensors; Stock: 245; Pricing: 1=4,11, 10=3,52, 50=3,2, 100=3,08, 1000=2,75, 10000=2,75 (USD); Mounting Technology: Surface Mount; Pins: 8; Housing Material: Plastic; Package Shape/Style: Rectangular; Terminal Finish: Tin; Min Operating Temperature: -55°C; Max Operating Temperature: 125°C; JESD-609 Code: e3; Technology: BICMOS; Termination: Solder; Reach SVHC Compliant: Yes; RoHS Compliant: Yes; ComponentLink1URL: https://datasheet.ciiva.com:443/pdfs/VipMasterIC/IC/MAXM/MAXMS01802/MAXMS01802-1.pdf?src-supplier=IHS+Markit; ComponentLink1Description: https://datasheet.ciiva.com:443/pdfs/VipMasterIC/IC/MAXM/MAXMS01802/MAXMS01802-1.pdf?src-supplier=IHS+Markit; ComponentLink2URL: https://datasheet.ciiva.com/5299/max6662-89142-5299456.pdf?src-supplier=Mouser; ComponentLink2Description: https://datasheet.ciiva.com/5299/max6662-89142-5299456.pdf?src-supplier=Mouser; ComponentLink3URL: https://datasheet.ciiva.com/3277/max6662-3277979.pdf?src-supplier=Avnet; ComponentLink3Description: https://datasheet.ciiva.com/3277/max6662-3277979.pdf?src-supplier=Avnet; ComponentLink4URL: https://datasheet.ciiva.com/2003/max6662-2003390.pdf?src-supplier=Digikey; ComponentLink4Description: https://datasheet.ciiva.com/2003/max6662-2003390.pdf?src-supplier=Digikey
X1 = CRYSTAL 16 MHz: Parallel - Fundamental Quartz Crystal, 16MHz Nom; Manufacturer: ECS International; Aging: 5 PPM/FIRST YEAR; Drive Level: 100uW; Frequency Stability: 0.005%; Frequency Tolerance: 30ppm; Load Capacitance: 20pF; ESR: 50R; Supplier: Mouser; Supplier Part Number: 520-ECS-160-20-30B; Manufacturer Part Number: ECS-160-20-30B-TR; RoHS: Yes; Category: Crystals; Stock: 688; Pricing: 1=0,86, 10=0,835, 50=0,835, 100=0,835, 1000=0,72, 10000=0,363 (USD); Mounting Technology: Surface Mount; Terminal Finish: Gold; Min Operating Temperature: -20°C; Max Operating Temperature: 70°C; JESD-609 Code: e4; Crystal/Resonator Type: PARALLEL - FUNDAMENTAL; Reach SVHC Compliant: Yes; RoHS Compliant: Yes; ComponentLink1URL: https://datasheet.ciiva.com:443/pdfs/VipMasterIC/IC/ECSI/ECSI-S-A0003724562/ECSI-S-A0003724562-1.pdf?src-supplier=IHS+Markit; ComponentLink1Description: https://datasheet.ciiva.com:443/pdfs/VipMasterIC/IC/ECSI/ECSI-S-A0003724562/ECSI-S-A0003724562-1.pdf?src-supplier=IHS+Markit; ComponentLink2URL: https://datasheet.ciiva.com/853/ecx-53b-853408.pdf?src-supplier=Digikey; ComponentLink2Description: https://datasheet.ciiva.com/853/ecx-53b-853408.pdf?src-supplier=Digikey; ComponentLink3URL: https://datasheet.ciiva.com/853/ecx-53b-853407.pdf?src-supplier=Digikey; ComponentLink3Description: https://datasheet.ciiva.com/853/ecx-53b-853407.pdf?src-supplier=Digikey; ComponentLink4URL: https://datasheet.ciiva.com/853/ecx-53b-853406.pdf?src-supplier=Digikey; ComponentLink4Description: https://datasheet.ciiva.com/853/ecx-53b-853406.pdf?src-supplier=Digikey
X2 = Crystal 32768KHz: Parallel - Fundamental Quartz Crystal, 0.032768MHz Nom; Manufacturer: Abracon; Manufacturer Part Number: ABS05-32.768KHZ-T; Manufacturer Series: ABS05; Additional Feature: TAPE AND REEL; Drive Level: 0.5uW; Frequency Stability: 0.0072%; Frequency Tolerance: 20ppm; Load Capacitance: 12.5pF; ESR: 90kR; Supplier: Mouser; Supplier Part Number: 815-ABS05-32.768K-T; RoHS: Yes; Category: Crystals; Stock: 58351; Pricing: 1=0,66, 10=0,54, 50=0,517, 100=0,469, 1000=0,431, 10000=0,345 (USD); Mounting Technology: Surface Mount; Min Operating Temperature: -40°C; Max Operating Temperature: 85°C; Crystal/Resonator Type: PARALLEL - FUNDAMENTAL; Reach SVHC Compliant: Yes; RoHS Compliant: Yes; ComponentLink1URL: https://datasheet.ciiva.com:443/pdfs/VipMasterIC/IC/ABRC/ABRC-S-A0001211237/ABRC-S-A0001211237-1.pdf?src-supplier=IHS+Markit; ComponentLink1Description: https://datasheet.ciiva.com:443/pdfs/VipMasterIC/IC/ABRC/ABRC-S-A0001211237/ABRC-S-A0001211237-1.pdf?src-supplier=IHS+Markit; ComponentLink2URL: https://datasheet.ciiva.com/23810/abs05-23810480.pdf?src-supplier=Newark; ComponentLink2Description: https://datasheet.ciiva.com/23810/abs05-23810480.pdf?src-supplier=Newark; ComponentLink3URL: https://datasheet.ciiva.com/6728/abs05-6728950.pdf?src-supplier=Digikey; ComponentLink3Description: https://datasheet.ciiva.com/6728/abs05-6728950.pdf?src-supplier=Digikey; ComponentLink4URL: https://datasheet.ciiva.com/6728/abs05-6728949.pdf?src-supplier=Digikey; ComponentLink4Description: https://datasheet.ciiva.com/6728/abs05-6728949.pdf?src-supplier=Digikey; ComponentLink5URL: https://datasheet.ciiva.com/16411/abs05-16411149.pdf?src-supplier=Future+Electronics; ComponentLink5Description: https://datasheet.ciiva.com/16411/abs05-16411149.pdf?src-supplier=Future+Electronics